# Altium schematic sheet Flash_eMMC_MicroSD.SchDoc
size 420 x 297 mm; Scale: 1:1; DocumentType: Схема электрическая принципиальная; SheetNumber: 14; SheetTotal: 32; DocumentTypeShort: Э3; DocumentInvertoryNumber: ㅤ
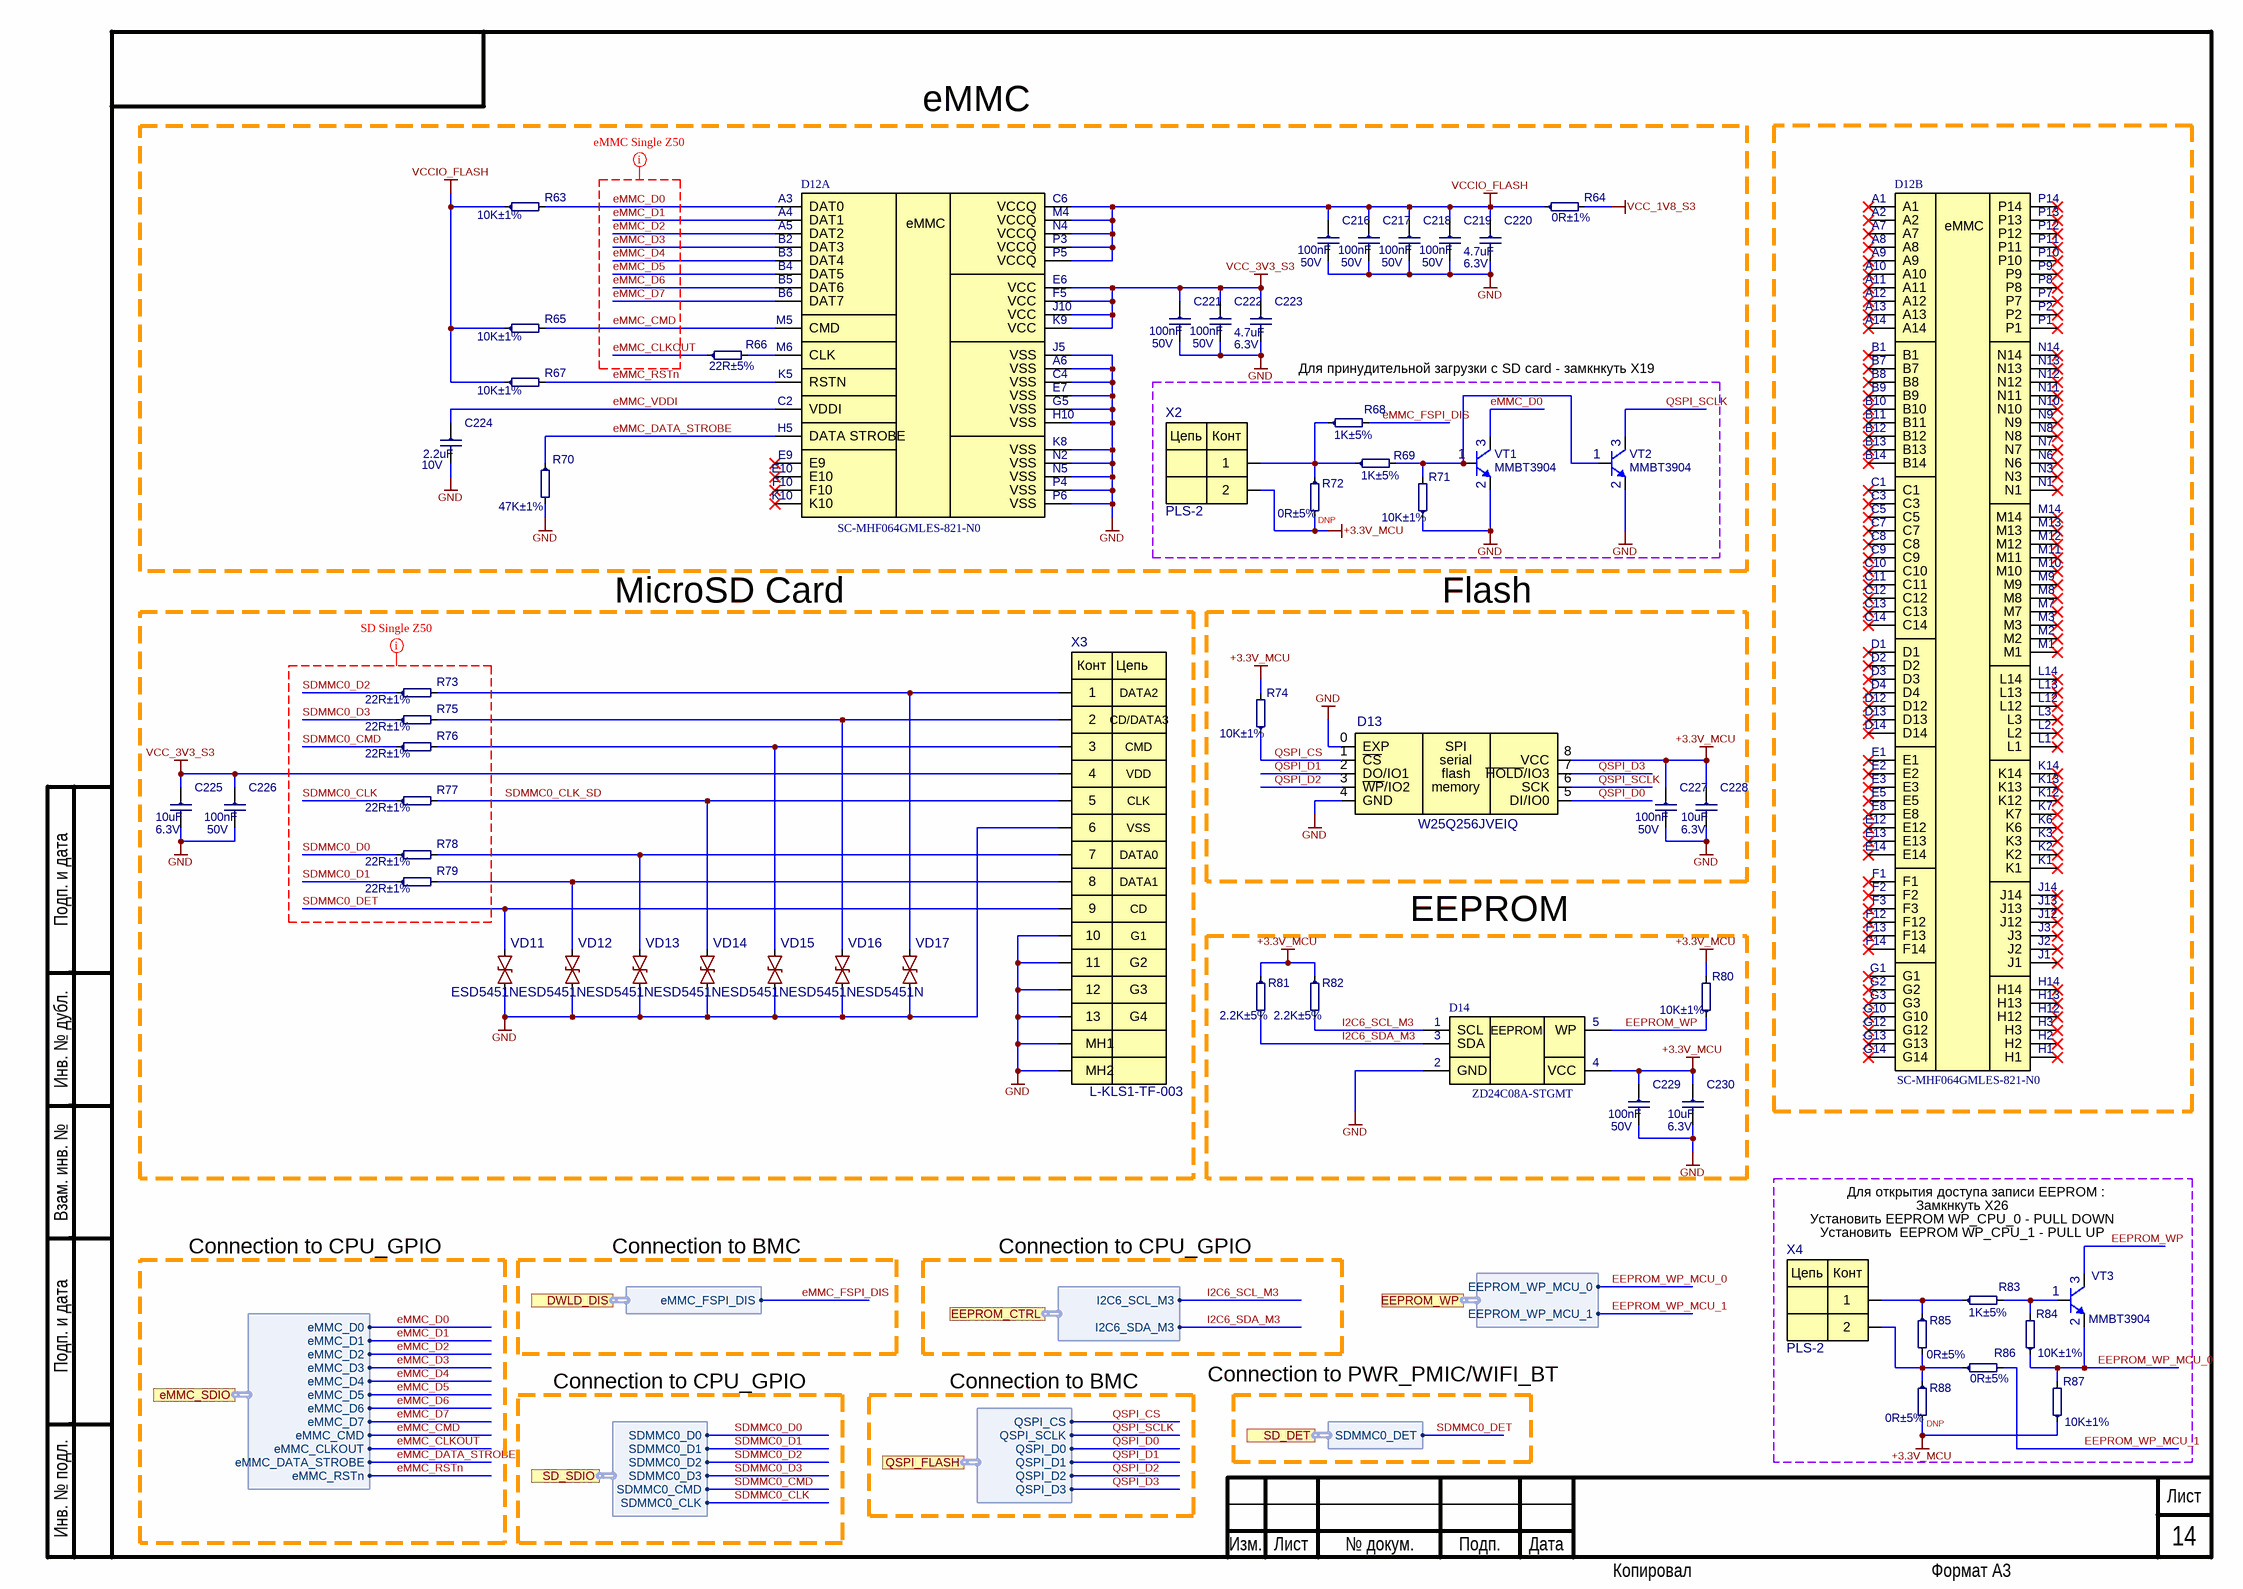
[diagram p0: Flash_eMMC_MicroSD.SchDoc]

## Parts
C216  100nF  Voltage: 50V  [C0402]
C217  100nF  Voltage: 50V  [C0402]
C218  100nF  Voltage: 50V  [C0402]
C219  100nF  Voltage: 50V  [C0402]
C220  4.7uF  Voltage: 6.3V  [C0402]
C221  100nF  Voltage: 50V  [C0402]
C222  100nF  Voltage: 50V  [C0402]
C223  4.7uF  Voltage: 6.3V  [C0402]
C224  2.2uF  Voltage: 10V  [C0402]
C225  10uF  Voltage: 6.3V  [C0402]
C226  100nF  Voltage: 50V  [C0402]
C227  100nF  Voltage: 50V  [C0402]
C228  10uF  Voltage: 6.3V  [C0402]
C229  100nF  Voltage: 50V  [C0402]
C230  10uF  Voltage: 6.3V  [C0402]
D12  SC-MHF064GMLES-821-N0  [SC-MHF064GMLES-821-N0]  (parts A,B of 2)
D13  W25Q256JVEIQ  [WSON-8-8x6]
D14  ZD24C08A-STGMT  [ZD24C08A-STGMT]
R63  10K±1%  [R0402]
R64  0R±1%  [R0603]
R65  10K±1%  [R0402]
R66  22R±5%  [R0402]
R67  10K±1%  [R0402]
R68  1K±5%  [R0402]
R69  1K±5%  [R0402]
R70  47K±1%  [R0402]
R71  10K±1%  [R0402]
R72  0R±5%  [R0402]
R73  22R±1%  [R0402]
R74  10K±1%  [R0402]
R75  22R±1%  [R0402]
R76  22R±1%  [R0402]
R77  22R±1%  [R0402]
R78  22R±1%  [R0402]
R79  22R±1%  [R0402]
R80  10K±1%  [R0402]
R81  2.2K±5%  [R0402]
R82  2.2K±5%  [R0402]
R83  1K±5%  [R0402]
R84  10K±1%  [R0402]
R85  0R±5%  [R0402]
R86  0R±5%  [R0402]
R87  10K±1%  [R0402]
R88  0R±5%  [R0402]
VD11  ESD5451N  [DFN_1006_2]
VD12  ESD5451N  [DFN_1006_2]
VD13  ESD5451N  [DFN_1006_2]
VD14  ESD5451N  [DFN_1006_2]
VD15  ESD5451N  [DFN_1006_2]
VD16  ESD5451N  [DFN_1006_2]
VD17  ESD5451N  [DFN_1006_2]
VT1  MMBT3904  [SOT23]
VT2  MMBT3904  [SOT23]
VT3  MMBT3904  [SOT23]
X2  PLS-2  [PLS2]
X3  L-KLS1-TF-003  [KLS1-TF-003]
X4  PLS-2  [PLS2]

## Blocks framed on the sheet
Для принудительной загрузки с SD card - замкнкуть X19: R68 R69 R71 R72 VT1 VT2 X2

## Ports
DWLD_DIS (harness DWLD_DIS), EEPROM_CTRL (harness EEPROM_CTRL), EEPROM_WP (harness EEPROM_WP), eMMC_SDIO (harness eMMC_SDIO), QSPI_FLASH (harness QSPI_FLASH), SD_DET (harness SD_DET), SD_SDIO (harness SD_SDIO)

## Harnesses
eMMC_SDIO: eMMC_D0, eMMC_D1, eMMC_D2, eMMC_D3, eMMC_D4, eMMC_D5, eMMC_D6, eMMC_D7, eMMC_CMD, eMMC_CLKOUT, eMMC_DATA_STROBE, eMMC_RSTn
SD_SDIO: SDMMC0_D0, SDMMC0_D1, SDMMC0_D2, SDMMC0_D3, SDMMC0_CMD, SDMMC0_CLK
DWLD_DIS: eMMC_FSPI_DIS
SD_DET: SDMMC0_DET
QSPI_FLASH: QSPI_CS, QSPI_SCLK, QSPI_D0, QSPI_D1, QSPI_D2, QSPI_D3
EEPROM_WP: EEPROM_WP_MCU_0, EEPROM_WP_MCU_1
EEPROM_CTRL: I2C6_SCL_M3, I2C6_SDA_M3

## Nets
+3.3V_MCU: C227.1 C228.1 C229.1 C230.1 D13.8(VCC) D14.4(VCC) R72.2 R74.2 R80.2 R81.1 R82.1 R87.1 R88.2 X2.2
GND: C216.2 C217.2 C218.2 C219.2 C220.2 C221.2 C222.2 C223.2 C224.2 C225.2 C226.2 C227.2 C228.2 C229.2 C230.2 D12.A6(VSS) D12.C4(VSS) D12.E7(VSS) D12.G5(VSS) D12.H10(VSS) D12.J5(VSS) D12.K8(VSS) D12.N2(VSS) D12.N5(VSS) D12.P4(VSS) D12.P6(VSS) D13.0(EXP) D13.4(GND) D14.2(GND) R70.2 R71.1 VD11.2 VD12.2 VD13.2 VD14.2 VD15.2 VD16.2 VD17.2 VT1.2(E) VT2.2(E) X3.6 X3.10 X3.11 X3.12 X3.13 X3.MH1 X3.MH2
VCC_1V8_S3: R64.2
VCC_3V3_S3: C221.1 C222.1 C223.1 C225.1 C226.1 D12.E6(VCC) D12.F5(VCC) D12.J10(VCC) D12.K9(VCC) X3.4
VCCIO_FLASH: C216.1 C217.1 C218.1 C219.1 C220.1 D12.C6(VCCQ) D12.M4(VCCQ) D12.N4(VCCQ) D12.P3(VCCQ) D12.P5(VCCQ) R63.1 R64.1 R65.1 R67.1
EEPROM_WP: D14.5(WP) R80.1 VT3.3(C)
EEPROM_WP_MCU_0: R84.1 R87.2 VT3.2(E) ; port EEPROM_WP.EEPROM_WP_MCU_0
EEPROM_WP_MCU_1: R86.2 ; port EEPROM_WP.EEPROM_WP_MCU_1
eMMC_CLKOUT: R66.1 ; port eMMC_SDIO.eMMC_CLKOUT
eMMC_CMD: D12.M5(CMD) R65.2 ; port eMMC_SDIO.eMMC_CMD
eMMC_D0: D12.A3(DAT0) R63.2 VT1.3(C) ; port eMMC_SDIO.eMMC_D0
eMMC_D1: D12.A4(DAT1) ; port eMMC_SDIO.eMMC_D1
eMMC_D2: D12.A5(DAT2) ; port eMMC_SDIO.eMMC_D2
eMMC_D3: D12.B2(DAT3) ; port eMMC_SDIO.eMMC_D3
eMMC_D4: D12.B3(DAT4) ; port eMMC_SDIO.eMMC_D4
eMMC_D5: D12.B4(DAT5) ; port eMMC_SDIO.eMMC_D5
eMMC_D6: D12.B5(DAT6) ; port eMMC_SDIO.eMMC_D6
eMMC_D7: D12.B6(DAT7) ; port eMMC_SDIO.eMMC_D7
eMMC_DATA_STROBE: D12.H5(DATA_STROBE) R70.1 ; port eMMC_SDIO.eMMC_DATA_STROBE
eMMC_FSPI_DIS: R68.2 ; port DWLD_DIS.eMMC_FSPI_DIS
eMMC_RSTn: D12.K5(RSTN) R67.2 ; port eMMC_SDIO.eMMC_RSTn
eMMC_VDDI: C224.1 D12.C2(VDDI)
I2C6_SCL_M3: D14.1(SCL) R82.2 ; port EEPROM_CTRL.I2C6_SCL_M3
I2C6_SDA_M3: D14.3(SDA) R81.2 ; port EEPROM_CTRL.I2C6_SDA_M3
QSPI_CS: D13.1(~{CS}) R74.1 ; port QSPI_FLASH.QSPI_CS
QSPI_D0: D13.5(DI/IO0) ; port QSPI_FLASH.QSPI_D0
QSPI_D1: D13.2(DO/IO1) ; port QSPI_FLASH.QSPI_D1
QSPI_D2: D13.3(~{WP}/IO2) ; port QSPI_FLASH.QSPI_D2
QSPI_D3: D13.7(~{HOLD}/IO3) ; port QSPI_FLASH.QSPI_D3
QSPI_SCLK: D13.6(SCK) VT2.3(C) ; port QSPI_FLASH.QSPI_SCLK
SDMMC0_CLK: R77.1 ; port SD_SDIO.SDMMC0_CLK
SDMMC0_CLK_SD: R77.2 VD14.1 X3.5
SDMMC0_CMD: R76.1 ; port SD_SDIO.SDMMC0_CMD
SDMMC0_D0: R78.1 ; port SD_SDIO.SDMMC0_D0
SDMMC0_D1: R79.1 ; port SD_SDIO.SDMMC0_D1
SDMMC0_D2: R73.1 ; port SD_SDIO.SDMMC0_D2
SDMMC0_D3: R75.1 ; port SD_SDIO.SDMMC0_D3
SDMMC0_DET: VD11.1 X3.9 ; port SD_DET.SDMMC0_DET
NetD12_M6: D12.M6(CLK) R66.2
NetR68_1: R68.1 R69.1 R72.1 X2.1
NetR69_2: R69.2 R71.2 VT1.1(B) VT2.1(B)
NetR73_2: R73.2 VD17.1 X3.1
NetR75_2: R75.2 VD16.1 X3.2
NetR76_2: R76.2 VD15.1 X3.3
NetR78_2: R78.2 VD13.1 X3.7
NetR79_2: R79.2 VD12.1 X3.8
NetR83_1: R83.1 R85.1 X4.1
NetR83_2: R83.2 R84.2 VT3.1(B)
NetR85_2: R85.2 R86.1 R88.1 X4.2

Not connected (* = marked no-connect by the designer): D12 A1* A2* A7* A8* A9* A10* A11* A12* A13* A14* B1* B7* B8* B9* B10* B11* B12* B13* B14* C1* C3* C5* C7* C8* C9* C10* C11* C12* C13* C14* D1* D2* D3* D4* D12* D13* D14* E1* E2* E3* E5* E8* E9* E10* E12* E13* E14* F1* F2* F3* F10* F12* F13* F14* G1* G2* G3* G10* G12* G13* G14* H1* H2* H3* H12* H13* H14* J1* J2* J3* J12* J13* J14* K1* K2* K3* K6* K7* K10* K12* K13* K14* L1* L2* L3* L12* L13* L14* M1* M2* M3* M7* M8* M9* M10* M11* M12* M13* M14* N1* N3* N6* N7* N8* N9* N10* N11* N12* N13* N14* P1* P2* P7* P8* P9* P10* P11* P12* P13* P14*

## Layout directives
net class eMMC: eMMC_CLKOUT, eMMC_CMD, eMMC_D0, eMMC_D1, eMMC_D2, eMMC_D3, eMMC_D4, eMMC_D5, eMMC_D6, eMMC_D7
net class SD: SDMMC0_CLK, SDMMC0_CMD, SDMMC0_D0, SDMMC0_D1, SDMMC0_D2, SDMMC0_D3, SDMMC0_DET

## Notes on the sheet
- eMMC
- (near R72) DNP
- MicroSD Card
- Flash
- EEPROM
- Замкнкуть X26
- Для открытия доступа записи EEPROM :
- Connection to CPU_GPIO
- Connection to BMC
- Установить EEPROM WP_CPU_0 - PULL DOWN
- Установить  EEPROM WP_CPU_1 - PULL UP
- Connection to PWR_PMIC/WIFI_BT
- (near R88) DNP
- Подп. и дата
- Инв. № дубл.
- Взам. инв. №
- Инв. № подл.
- Изм.
- Лист
- № докум.
- Подп.
- Дата
- Копировал
- Формат А3
- (in symbol L-KLS1-TF-003) Конт; Цепь; DATA2; CD/DATA3; CMD; VDD; CLK; VSS; DATA0; DATA1; CD; G1; G2; G3; G4
- (in symbol PLS-2) Цепь; Конт
- (in symbol SC-MHF064GMLES-821-N0, part A) eMMC
- (in symbol SC-MHF064GMLES-821-N0, part B) eMMC
- (in symbol W25Q512JVEIQ) SPI; serial; flash; memory
- (in symbol ZD24C08A-STGMT) EEPROM

## Library data of the parts
C216-C219 C221 C222 C226 C227 C229 = 0402-X7R-50V-0.1uF±10%: Ceramic Capacitor 0402 100nF ±10% 50V X7R; Manufacturer: Yageo; NameFromManufacturer: CC0402KRX7R9BB104; Place: *); Check: False; Dielectric: X7R; Case: C0402; Part Number: 0402-X7R-50V-0.1uF±10%; Value: 100nF; Tolerance: 10%; Temperature: -55°C~125°C; ComponentLink2Description: Link to datasheet; ComponentLink1Description: DATASHEET; ComponentLink2URL: https://www.lcsc.com/product-detail/Multilayer-Ceramic-Capacitors-MLCC-SMD-SMT_YAGEO-CC0402KRX7R9BB104_C131394.html; Last changed: 09.04.2025
C220 C223 = 0402-X5R-6.3V-4.7uF±20%: Ceramic Capacitor 0402 4.7uF ±20% 6.3V X5R; Manufacturer: Yageo; NameFromManufacturer: CC0402MRX5R5BB475; Place: *); Check: False; Dielectric: X5R; Case: C0402; Part Number: 0402-X5R-6.3V-4.7uF±20%; Value: 4.7uF; Tolerance: 20%; Temperature: -55°C~125°C; ComponentLink2Description: Link to datasheet; ComponentLink1Description: DATASHEET; ComponentLink2URL: https://ru.mouser.com/ProductDetail/YAGEO/CC0402MRX5R5BB475?qs=%2Fha2pyFadujQAk9rG2cgJpeZ0BKEEZe0MyMZqMwsns5cG502XdwDVw%3D%3D; ComponentLink1URL: Datasheets/capacitors/UPY-GPHC_X5R_4V-to-50V_27.pdf; Last changed: 27.10.2022
C224 = 0402-X5R-10V-2.2uF±10%: *; Manufacturer: Yageo; NameFromManufacturer: CC0402KRX5R6BB225; Dielectric: X5R; Place: *); Tolerance: 10%; Check: False; Case: C0402; Part Number: 0402-X5R-10V-2.2uF±10%; Value: 2.2uF; Temperature: -55°C~85°C; ComponentLink2Description: Link to datasheet; ComponentLink1Description: DATASHEET; ComponentLink2URL: https://ru.mouser.com/ProductDetail/YAGEO/CC0402KRX5R6BB225?qs=%2Fha2pyFadujgDGyIaqGI8bfvbfiNNcC7p03y2QorR%252BZcRhliH8dUqw%3D%3D; ComponentLink1URL: Datasheets/capacitors/UPY-GPHC_X5R_4V-to-50V_27.pdf; Last changed: 27.10.2022
C225 C228 C230 = 0402-X5R-6.3V-10uF±20%: Manufacturer: Yageo; NameFromManufacturer: CC0402MRX5R5BB106; Dielectric: X5R; Place: *); Tolerance: 20%; Check: False; Case: C0402; Part Number: 0402-X5R-6.3V-10uF±20%; Value: 10uF; Temperature: -55°C~125°C; ComponentLink2Description: Link to datasheet; ComponentLink1Description: DATASHEET; ComponentLink2URL: https://ru.mouser.com/ProductDetail/YAGEO/CC0402MRX5R5BB106?qs=%2Fha2pyFadujQAk9rG2cgJj8l7IbODD3KVaDjvxAcKzu9LtlLnRlq6Q%3D%3D; ComponentLink1URL: Datasheets/capacitors/UPY-GPHC_X5R_4V-to-50V_27.pdf; Last changed: 27.10.2022
D12 = SC-MHF064GMLES-821-N0: Flash Card 64G-bytes 1.8V/3.3V Embedded MMC 153-Pin FBGA; Manufacturer: Samsung; Analog: KLM8G1GETF-B041; Check: False; Part Number: SC-MHF064GMLES-821-N0; NameFromManufacturer: SC-MHF064GMLES-821-N0; Value: SC-MHF064GMLES-821-N0; ComponentLink1Description: DATASHEET; Last changed: 24.03.2023
D13 = W25Q512JVEIQ: 3V 256M-BIT SERIAL FLASH MEMORY WITH DUAL/QUAD SPI; Manufacturer: Winbond; Place: *); Check: False; Part Number: W25Q256JVEIQ; Temperature: -40°C~85°C; Value: W25Q256JVEIQ; ComponentLink1Description: DATASHEET; NameFromManufacturer: W25Q256JVEIQ; ComponentLink1URL: https://www.digikey.com/en/products/detail/winbond-electronics/W25Q512JVEIQ/10244706; Datasheet: Datasheets/ic/W25Q512JV_SPI_RevF_09032021Plus.pdf; Last changed: 27.10.2022
D14 = ZD24C08A-STGMT: 8Kbit 1MHz I2C SOT-23-5 EEPROM; Manufacturer: Zetta; Check: False; Part Number: ZD24C08A-STGMT; NameFromManufacturer: ZD24C08A-STGMT; Value: ZD24C08A-STGMT
R63 R65 R67 R71 R74 R80 R84 R87 = 0402-0.0625W-10K-100ppm±1%: Chip Resistor 0402 10kΩ ±1% 50V ±100ppm/℃ Thick Film; NameFromManufacturer: RC0402FR-0710KL; Manufacturer: Yageo; Place: *); Value: 10K; Check: False; Case: R0402; Part Number: 0402-0.0625W-10K-100ppm±1%; Tolerance: 1%; Temperature: -55°C~155°C; ComponentLink1Description: DATASHEET; ComponentLink1URL: https://ru.mouser.com/ProductDetail/YAGEO/RC0402FR-0710KL?qs=%2Fha2pyFaduhjtLcYvKXQ8IogF7YwN7YtH%252BOO8ZtEEMnoa4yoWYcwpw%3D%3D; Datasheet: Datasheets/resistors/PYu-RC_Group_51_RoHS_L_11.pdf; Last changed: 27.10.2022
R64 = 0603-0.1W-0R-200ppm±1%: NameFromManufacturer: RC0603FR-070RL; Manufacturer: Yageo; Place: *); Value: 0R; Tolerance: 1%; Check: False; Case: R0603; Part Number: 0603-0.1W-0R-200ppm±1%; Temperature: -55°C~155°C; ComponentLink1Description: DATASHEET; ComponentLink1URL: https://www.yageo.com/upload/media/product/productsearch/datasheet/rchip/PYu-RC_Group_51_RoHS_L_11.pdf; Datasheet: Datasheets/resistors/PYu-RC_Group_51_RoHS_L_11.pdf; Last changed: 27.10.2022
R66 = 0402-0.0625W-22R-100ppm±5%: NameFromManufacturer: RC0402JR-0722RL; Manufacturer: Yageo; Place: *); Value: 22R; Tolerance: 5%; Check: False; Case: R0402; Part Number: 0402-0.0625W-22R-100ppm±5%; Temperature: -55°C~155°C; ComponentLink1Description: DATASHEET; ComponentLink1URL: https://www.terraelectronica.ru/pdf/show?pdf_file=%252Fds%252Fpdf%252FR%252FRC0402.pdf; Datasheet: Datasheets/resistors/PYu-RC_Group_51_RoHS_L_12.pdf; Last changed: 27.10.2022
R68 R69 R83 = 0402-0.0625W-1K-100ppm±5%: NameFromManufacturer: RC0402JR-071KL; Manufacturer: Yageo; Place: *); Value: 1K; Tolerance: 5%; Check: False; Case: R0402; Part Number: 0402-0.0625W-1K-100ppm±5%; Temperature: -55°C~155°C; ComponentLink1Description: DATASHEET; ComponentLink1URL: https://ru.mouser.com/ProductDetail/YAGEO/RC0402JR-071KL?qs=%2Fha2pyFadugNN0LzwXn2qBG%2Fxv0pCy6gh7Z%252B1hZJT2CnjLeHVORGDQ%3D%3D; Datasheet: Datasheets/resistors/PYu-RC_Group_51_RoHS_L_11.pdf; Last changed: 27.10.2022
R70 = 0402-0.0625W-47K-100ppm±1%: NameFromManufacturer: RC0402FR-0747KL; Manufacturer: Yageo; Place: *); Value: 47K; Tolerance: 1%; Check: False; Case: R0402; Part Number: 0402-0.0625W-47K-100ppm±1%; Temperature: -55°C~155°C; ComponentLink1Description: DATASHEET; ComponentLink1URL: https://www.terraelectronica.ru/pdf/show?pdf_file=%252Fds%252Fpdf%252FR%252FRC0402.pdf; Datasheet: Datasheets/resistors/PYu-RC_Group_51_RoHS_L_12.pdf; Last changed: 27.10.2022
R72 R85 R86 R88 = 0402-0.0625W-0R-100ppm±5%: NameFromManufacturer: RC0402JR-070RL; Manufacturer: Yageo; Place: *); Value: 0R; Tolerance: 5%; Check: False; Case: R0402; Part Number: 0402-0.0625W-0R-100ppm±5%; Temperature: -55°C~155°C; ComponentLink1Description: DATASHEET; ComponentLink1URL: https://ru.mouser.com/ProductDetail/YAGEO/RC0402JR-070RL?qs=%2Fha2pyFadugNN0LzwXn2qP7HsQ9BBU71VWxeSOFlFaYv9aVJHghTrg%3D%3D; Datasheet: Datasheets/resistors/PYu-RC_Group_51_RoHS_L_11.pdf; Last changed: 27.10.2022
R73 R75-R79 = 0402-0.0625W-22R-100ppm±1%: Chip Resistor 0402 22Ω ±1% 50V ±100ppm/℃ Thick Film; NameFromManufacturer: RC0402FR-0722RL; Manufacturer: Yageo; Place: *); Value: 22R; Check: False; Case: R0402; Part Number: 0402-0.0625W-22R-100ppm±1%; Tolerance: 1%; Temperature: -55°C~155°C; ComponentLink1Description: DATASHEET; ComponentLink1URL: https://www.yageo.com/upload/media/product/productsearch/datasheet/rchip/PYu-RC_Group_51_RoHS_L_11.pdf; Datasheet: Datasheets/resistors/PYu-RC_Group_51_RoHS_L_11.pdf; Last changed: 27.10.2022
R81 R82 = 0402-0.0625W-2.2K-100ppm±5%: *; NameFromManufacturer: RC0402JR-072K2L; Manufacturer: Yageo; Place: *); Value: 2.2K; Tolerance: 5%; Check: False; Case: R0402; Part Number: 0402-0.0625W-2.2K-100ppm±5%; Temperature: -55°C~155°C; ComponentLink1Description: DATASHEET; ComponentLink1URL: https://octopart.com/ac0402jr-072k2l-yageo-23514430?r=sp; Datasheet: Datasheets/resistors/PYu-AC_51_RoHS_L_8.pdf; Last changed: 27.10.2022
VD11-VD17 = ESD5451N: Bidirectional TVS Diode 5V; Manufacturer: Tech Public Co.; Place: *); Check: False; Part Number: ESD5451N; Value: ESD5451N; Temperature: -65°C~150°C; ComponentLink1Description: DATASHEET; NameFromManufacturer: ESD5451N; Last changed: 13.04.2023
VT1-VT3 = MMBT3904: NPN transistor; Manufacturer: Diotec Semiconductor; Place: S; Voltage: 40V; Check: False; Part Number: MMBT3904; Value: MMBT3904; Temperature: -55°C~150°C; ComponentLink1Description: DATASHEET; NameFromManufacturer: MMBT3904; ComponentLink1URL: https://www.terraelectronica.ru/product/607582; Datasheet: #https://diotec.com/request/datasheet/mmbt3904.pdf#; Last changeв: 01.09.2022
X2 X4 = PLS-2: Terminal block 2; Manufacturer: NXU; Place: T; Check: False; Part Number: PLS-2; Value: PLS-2; Temperature: -25°C~85°C; ComponentLink1Description: DATASHEET; NameFromManufacturer: PLS-2; Datasheet: Datasheets/connectors/pld_pls_01.pdf; Last changed: 27.10.2022
X3 = L-KLS1-TF-003: L-KLS1-TF-003 Push-Push H1.85mm With CD Pin Micro SD Card Connector; Manufacturer: KLS; Check: False; Part Number: L-KLS1-TF-003; Value: L-KLS1-TF-003; NameFromManufacturer: L-KLS1-TF-003